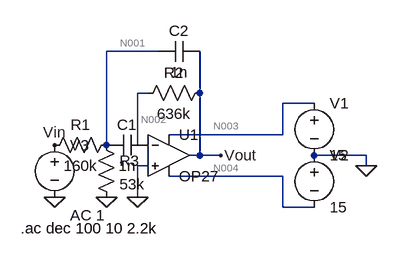
[diagram p0: schematic Draft1.asc]
Draft1.asc, the LTspice schematic file:
Version 4
SHEET 1 880 680
WIRE 208 32 128 32
WIRE 192 96 176 96
WIRE 272 96 272 32
WIRE 448 112 400 112
WIRE 400 160 400 112
WIRE 400 160 224 160
WIRE 128 176 128 32
WIRE 176 176 176 96
WIRE 272 192 272 96
WIRE 272 192 256 192
WIRE 304 192 272 192
WIRE 528 192 448 192
WIRE 192 208 176 208
WIRE 528 208 528 192
WIRE 400 224 224 224
WIRE 176 256 176 208
WIRE 400 272 400 224
WIRE 448 272 400 272
FLAG 528 208 0
FLAG 304 192 Vout
FLAG 48 176 Vin
FLAG 128 256 0
FLAG 48 256 0
FLAG 176 256 0
SYMBOL voltage 448 96 R0
WINDOW 123 0 0 Left 0
WINDOW 39 0 0 Left 0
SYMATTR InstName V1
SYMATTR Value 15
SYMBOL voltage 448 176 R0
WINDOW 123 0 0 Left 0
WINDOW 39 0 0 Left 0
SYMATTR InstName V2
SYMATTR Value 15
SYMBOL cap 192 160 R90
WINDOW 0 0 32 VBottom 2
WINDOW 3 32 32 VTop 2
SYMATTR InstName C1
SYMATTR Value 1n
SYMBOL res 144 160 R90
WINDOW 0 0 56 VBottom 2
WINDOW 3 32 56 VTop 2
SYMATTR InstName R1
SYMATTR Value 160k
SYMBOL res 288 80 R90
WINDOW 0 0 56 VBottom 2
WINDOW 3 32 56 VTop 2
SYMATTR InstName R2
SYMATTR Value 636k
SYMBOL cap 272 16 R90
WINDOW 0 0 32 VBottom 2
WINDOW 3 32 32 VTop 2
SYMATTR InstName C2
SYMATTR Value 1n
SYMBOL res 112 160 R0
SYMATTR InstName R3
SYMATTR Value 53k
SYMBOL voltage 48 160 R0
WINDOW 3 24 152 Left 2
WINDOW 123 24 124 Left 2
WINDOW 39 0 0 Left 0
SYMATTR InstName V3
SYMATTR Value ""
SYMATTR Value2 AC 1
SYMBOL OpAmps\\OP27 224 128 R0
SYMATTR InstName U1
TEXT -4 304 Left 2 !.ac dec 100 10 2.2k

The netlist it stands for:
* Draft1.asc
V1 N003 0 15
V2 0 N004 15
C1 P001 N001 1n
R1 N001 Vin 160k
R2 Vout N002 636k
C2 Vout N001 1n
R3 N001 0 53k
V3 Vin 0 AC 1
XU1 0 P001 N003 N004 Vout OP27  ; pins In+ In- V+ V- OUT
.ac dec 100 10 2.2k
.lib ADI.lib
.backanno
.end

* Results of the author's LTspice run, read from the files saved beside the schematic
* Operating Point, zero values left out:
*   V(n003) = 15 V
*   V(n004) = -15 V
*   I(V1) = -2.968 mA
*   I(V2) = -2.968 mA
*   Ix(u1:3) = 2.968 mA
*   Ix(u1:4) = -2.968 mA
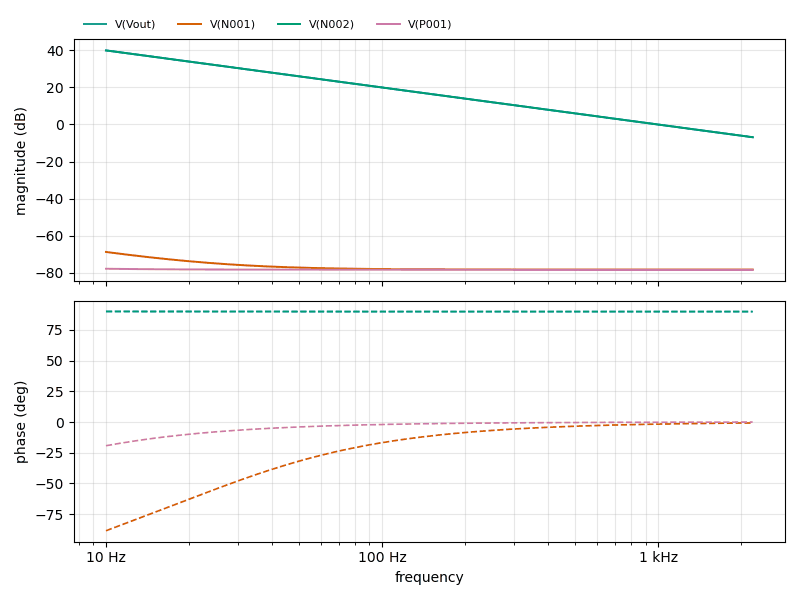
[diagram p1: AC Analysis of Draft1.asc, plotted from the saved traces]
* AC Analysis, 1 run:
*   V(Vout): 39.95 dB at 10 Hz, -6.90 dB at 2.2 kHz, peak 39.95 dB at 10 Hz, 3 dB below the peak at 14.14 Hz
*   V(N001): -68.81 dB at 10 Hz, -78.35 dB at 2.2 kHz, peak -68.81 dB at 10 Hz, 3 dB below the peak at 14.67 Hz
*   V(N002): 39.95 dB at 10 Hz, -6.90 dB at 2.2 kHz, peak 39.95 dB at 10 Hz, 3 dB below the peak at 14.14 Hz
*   V(P001): -77.88 dB at 10 Hz, -78.39 dB at 2.2 kHz, peak -77.88 dB at 10 Hz